# EAGLE design FinalPCBLayoutPoV (EAGLE 7.5.0)
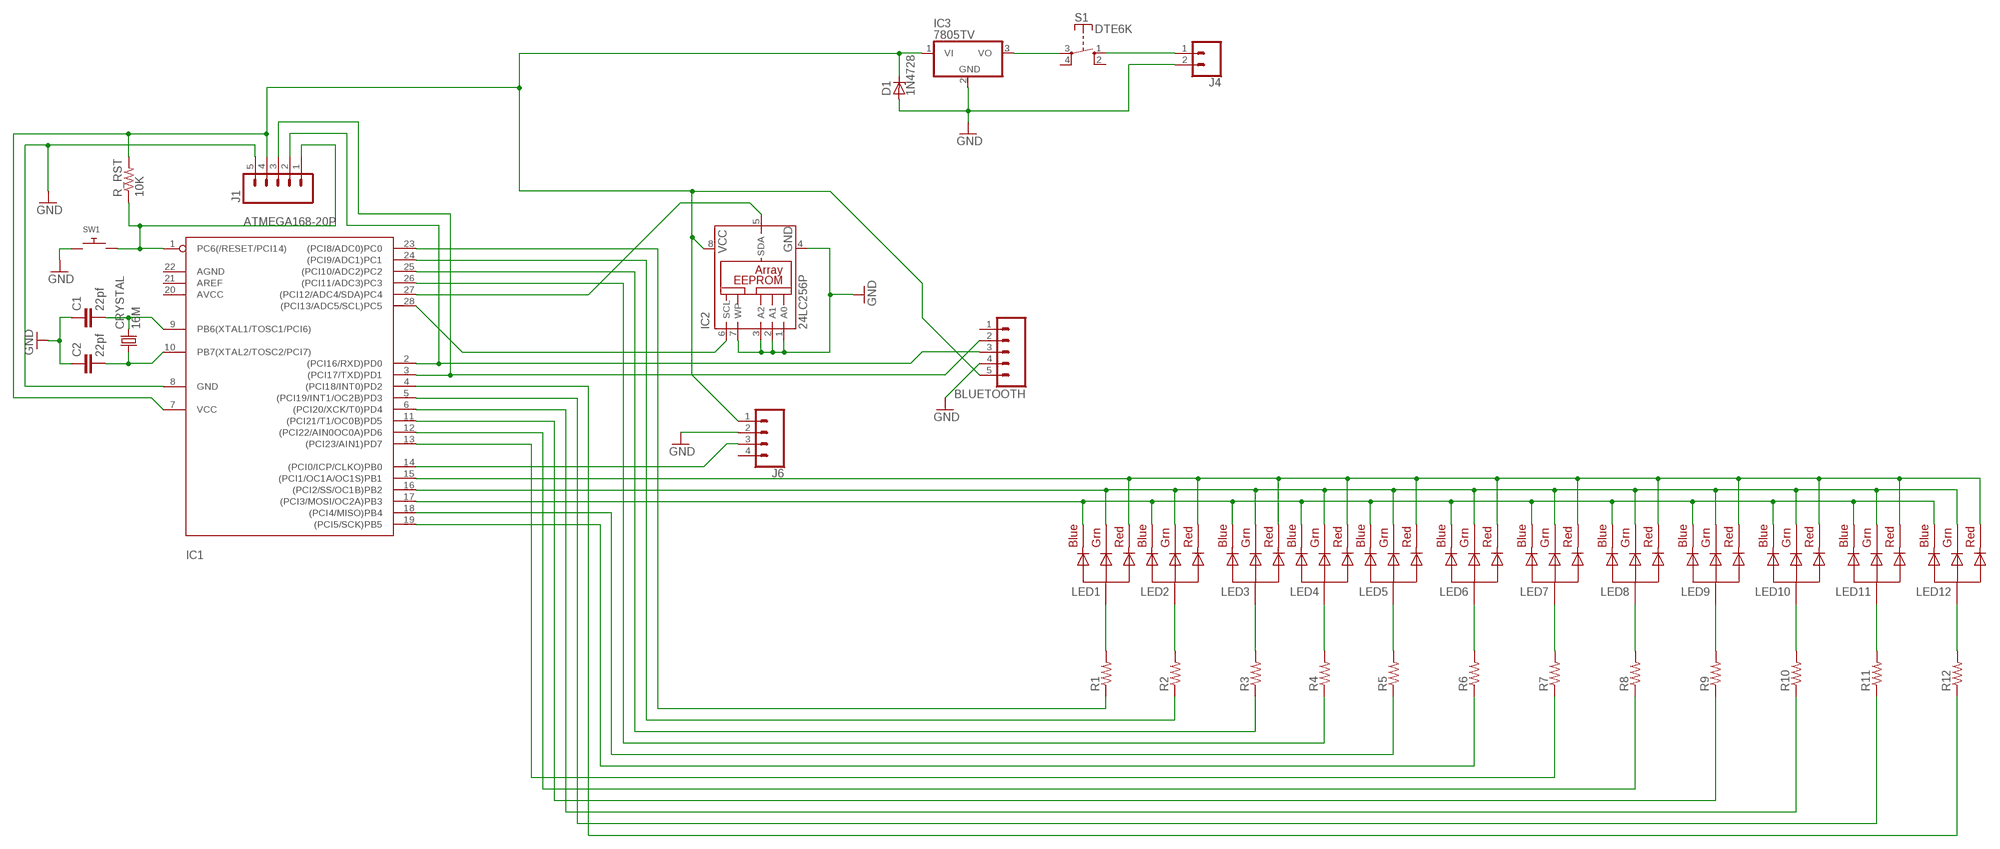
[diagram p0: schematic, sheet 1]

## Parts
BLUETOOTH  M05SCREW  [SCREWTERMINAL-3.5MM-5]
C1  22pf  C-EU025-060X050  [C025-060X050]
C2  22pf  C-EU025-060X050  [C025-060X050]
CRYSTAL  16M  CRYSTALHC49S  [HC49/S]
D1  1N4728  [DO41Z10]
IC1  ATMEGA168-20P  [DIL28-3]
IC2  24LC256P  [DIL8]
IC3  7805TV  [TO220V]
J1  M05SCREW  [SCREWTERMINAL-3.5MM-5]
J4  CONN_02PTH3  [1X02_LONGPADS]
J6  CONN_04LONGPADS  [1X04_LONGPADS]
LED1  RGBLED_CA-5MM  [LED5MMRGB]
LED2  RGBLED_CA-5MM  [LED5MMRGB]
LED3  RGBLED_CA-5MM  [LED5MMRGB]
LED4  RGBLED_CA-5MM  [LED5MMRGB]
LED5  RGBLED_CA-5MM  [LED5MMRGB]
LED6  RGBLED_CA-5MM  [LED5MMRGB]
LED7  RGBLED_CA-5MM  [LED5MMRGB]
LED8  RGBLED_CA-5MM  [LED5MMRGB]
LED9  RGBLED_CA-5MM  [LED5MMRGB]
LED10  RGBLED_CA-5MM  [LED5MMRGB]
LED11  RGBLED_CA-5MM  [LED5MMRGB]
LED12  RGBLED_CA-5MM  [LED5MMRGB]
R1  R-US_0207/10  [0207/10]
R2  R-US_0207/10  [0207/10]
R3  R-US_0207/10  [0207/10]
R4  R-US_0207/10  [0207/10]
R5  R-US_0207/10  [0207/10]
R6  R-US_0207/10  [0207/10]
R7  R-US_0207/10  [0207/10]
R8  R-US_0207/10  [0207/10]
R9  R-US_0207/10  [0207/10]
R10  R-US_0207/10  [0207/10]
R11  R-US_0207/10  [0207/10]
R12  R-US_0207/10  [0207/10]
R_RST  10K  R-US_0207/10  [0207/10]
S1  DTE6K  [DTE6K]
SW1  SWITCH_PUSHBUTTONEVQ-PE  [TACT_PANA-EVQ]

## Nets
CRTL1: C1.2 CRYSTAL.2 IC1.9(PB6(XTAL1/TOSC1/PCI6))
CRTL2: C2.2 CRYSTAL.1 IC1.10(PB7(XTAL2/TOSC2/PCI7))
CRX-BTX: BLUETOOTH.3 IC1.2((PCI16/RXD)PD0) J1.2
CTX-BRX: BLUETOOTH.2 IC1.3((PCI17/TXD)PD1) J1.3
GND: BLUETOOTH.4 C1.1 C2.1 D1.A IC1.8(GND) IC2.1(A0) IC2.2(A1) IC2.3(A2) IC2.4(GND) IC2.7(WP) IC3.2(GND) J1.5 J4.2 J6.2 SW1.P$1
LED1: IC1.23((PCI8/ADC0)PC0) R1.1
LED2: IC1.24((PCI9/ADC1)PC1) R2.1
LED3: IC1.25((PCI10/ADC2)PC2) R3.1
LED4: IC1.26((PCI11/ADC3)PC3) R4.1
LED5: IC1.18((PCI4/MISO)PB4) R5.1
LED6: IC1.19((PCI5/SCK)PB5) R6.1
LED7: IC1.13((PCI23/AIN1)PD7) R7.1
LED8: IC1.12((PCI22/AIN0OC0A)PD6) R8.1
LED9: IC1.11((PCI21/T1/OC0B)PD5) R9.1
LED10: IC1.6((PCI20/XCK/T0)PD4) R10.1
LED11: IC1.5((PCI19/INT1/OC2B)PD3) R11.1
LED12: IC1.4((PCI18/INT0)PD2) R12.1
N$1: IC3.3(VO) S1.3(P)
N$2: J4.1 S1.1(S)
N$3: IC1.14((PCI0/ICP/CLKO)PB0) J6.3
N$12: IC1.27((PCI12/ADC4/SDA)PC4) IC2.5(SDA)
N$13: IC1.28((PCI13/ADC5/SCL)PC5) IC2.6(SCL)
N$34: LED1.2(VCC) R1.2
N$35: LED2.2(VCC) R2.2
N$36: LED3.2(VCC) R3.2
N$37: LED4.2(VCC) R4.2
N$38: LED5.2(VCC) R5.2
N$39: LED6.2(VCC) R6.2
N$40: LED7.2(VCC) R7.2
N$41: LED8.2(VCC) R8.2
N$42: LED9.2(VCC) R9.2
N$43: LED10.2(VCC) R10.2
N$44: LED11.2(VCC) R11.2
N$45: LED12.2(VCC) R12.2
PWM-BLUE: IC1.17((PCI3/MOSI/OC2A)PB3) LED1.4(BLUE) LED2.4(BLUE) LED3.4(BLUE) LED4.4(BLUE) LED5.4(BLUE) LED6.4(BLUE) LED7.4(BLUE) LED8.4(BLUE) LED9.4(BLUE) LED10.4(BLUE) LED11.4(BLUE) LED12.4(BLUE)
PWM-GREEN: IC1.16((PCI2/SS/OC1B)PB2) LED1.3(GREEN) LED2.3(GREEN) LED3.3(GREEN) LED4.3(GREEN) LED5.3(GREEN) LED6.3(GREEN) LED7.3(GREEN) LED8.3(GREEN) LED9.3(GREEN) LED10.3(GREEN) LED11.3(GREEN) LED12.3(GREEN)
PWM-READ: IC1.15((PCI1/OC1A/OC1S)PB1) LED1.1(RED) LED2.1(RED) LED3.1(RED) LED4.1(RED) LED5.1(RED) LED6.1(RED) LED7.1(RED) LED8.1(RED) LED9.1(RED) LED10.1(RED) LED11.1(RED) LED12.1(RED)
RST: IC1.1(PC6(/RESET/PCI14)) J1.1 R_RST.1 SW1.P$2
VCC1: BLUETOOTH.5 D1.C IC1.7(VCC) IC2.8(VCC) IC3.1(VI) J1.4 J6.1 R_RST.2
Unconnected: BLUETOOTH.1 IC1.20(AVCC) IC1.21(AREF) IC1.22(AGND) J6.4 S1.2(S) S1.4(P)

## Library data of the parts
BLUETOOTH J1 = SparkFun-ConnectorsModified:M05: Header 5 Standard 5-pin 0.1" header. Use with straight break away headers (SKU : PRT-00116), right angle break away headers (PRT-00553), swiss pins (PRT-00743), machine pins (PRT-00117), and female headers (PRT-00115). Molex polarized connector foot print use with SKU : PRT-08230 with associated crimp pins and housings.; PROD_ID: Combine 8288+8399
C1 C2 = rcl-2M:C-EU: CAPACITOR, European symbol
CRYSTAL = crystal:CRYSTAL: CRYSTAL; OC_FARNELL: 1667008; OC_NEWARK: unknown
D1 = diode:1N4728: Z DIODE 3.3 V, 1W, 5 percent
IC1 = adafruitModified:ATMEGA168*P: MICROCONTROLLER 16 kBytes FLASH 1 kBytes SRAM 512 Bytes EEPROM USART 8-channel 10 bit ADC
IC2 = microchip:24*: Serial EEPROM I2C; MF: MICROCHIP; MPN: 24LC256-E/P; OC_FARNELL: 9757970; OC_NEWARK: 92C7169
IC3 = linear:78*: Positive VOLTAGE REGULATOR Source: http://cache.national.com/ds/LM/LM78L05.pdf http://www.fairchildsemi.com/ds/LM/LM7805.pdf
J4 = SparkFun-Connectors:CONN_02: Multi connection point. Often used as Generic Header-pin footprint for 0.1 inch spaced/style header connections On any of the 0.1 inch spaced packages, you can populate with these: Break Away Headers - Straight <https://www.sparkfun.com/products/116> (PRT-00116) Break Away Male Headers - Right Angle <https://www.sparkfun.com/products/553> (PRT-00553) Female Headers <https://www.sparkfun.com/products/115> (PRT-00115) Break Away Headers - Machine Pin <https://www.sparkfun.com/products/117> (PRT-00117) Break Away Female Headers - Swiss Machine Pin <https://www.sparkfun.com/products/743> (PRT-00743) For SCREWTERMINALS and SPRING TERMINALS visit here: Screw Terimnals on SparkFun.com <https://www.sparkfun.com/search/results?term=Screw+Terminals> (5mm/3.5mm/2.54mm spacing) This device is also useful as a general connection point to wire up your design to another part of your project. Our various solder wires solder well into these plated through hole pads. Hook-Up Wire - Assortment (Stranded, 22 AWG) <https://www.sparkfun.com/products/11375> (PRT-11375) Hook-Up Wire - Assortment (Solid Core, 22 AWG) <https://www.sparkfun.com/products/11367> (PRT-11367) View the entire wire category on our website here <https://www.sparkfun.com/categories/141> Special notes: Molex polarized connector foot print use with: PRT-08233 with associated crimp pins and housings. 2.54_SCREWTERM for use with PRT-10571. 3.5mm Screw Terminal footprints for PRT-08084 5mm Screw Terminal footprints for use with PRT-08432
J6 = SparkFun-Connectors:CONN_04: Multi connection point. Often used as Generic Header-pin footprint for 0.1 inch spaced/style header connections On any of the 0.1 inch spaced packages, you can populate with these: Break Away Headers - Straight <https://www.sparkfun.com/products/116> (PRT-00116) Break Away Male Headers - Right Angle <https://www.sparkfun.com/products/553> (PRT-00553) Female Headers <https://www.sparkfun.com/products/115> (PRT-00115) Break Away Headers - Machine Pin <https://www.sparkfun.com/products/117> (PRT-00117) Break Away Female Headers - Swiss Machine Pin <https://www.sparkfun.com/products/743> (PRT-00743) For SCREWTERMINALS and SPRING TERMINALS visit here: Screw Terimnals on SparkFun.com <https://www.sparkfun.com/search/results?term=Screw+Terminals> (5mm/3.5mm/2.54mm spacing) This device is also useful as a general connection point to wire up your design to another part of your project. Our various solder wires solder well into these plated through hole pads. Hook-Up Wire - Assortment (Stranded, 22 AWG) <https://www.sparkfun.com/products/11375> (PRT-11375) Hook-Up Wire - Assortment (Solid Core, 22 AWG) <https://www.sparkfun.com/products/11367> (PRT-11367) View the entire wire category on our website here <https://www.sparkfun.com/categories/141> Special notes: Molex polarized connector foot print use with SKU : PRT-08231 with associated crimp pins and housings. 1MM SMD Version SKU: PRT-10208; PROD_ID: CONN-09696
LED1-LED12 = adafruitModified:RGBLED_CA: RGB LED, common-anode 5MM Staggered pins 5mm Piranha package http://www.ladyada.net/library/pcb/eaglelibrary.html
R1-R12 R_RST = rcl-2M:R-US_: RESISTOR, American symbol
S1 = switch-misc:DT: ITT SWITCH
SW1 = adafruitMs:SWITCH_PUSHBUTTON: Buttons SOFTTOUCHSMD_SJ - Soft touch temporary push button (Super Junk Akihabara) Compatible with SKPMANE010 [Mouser: 688-SKPMAN] C&K_KSS = Digikey: KSS221GLFS

## Net classes
0 default: width 0.61 mm, drill 0.406 mm, clearance 0.61 mm

## Board
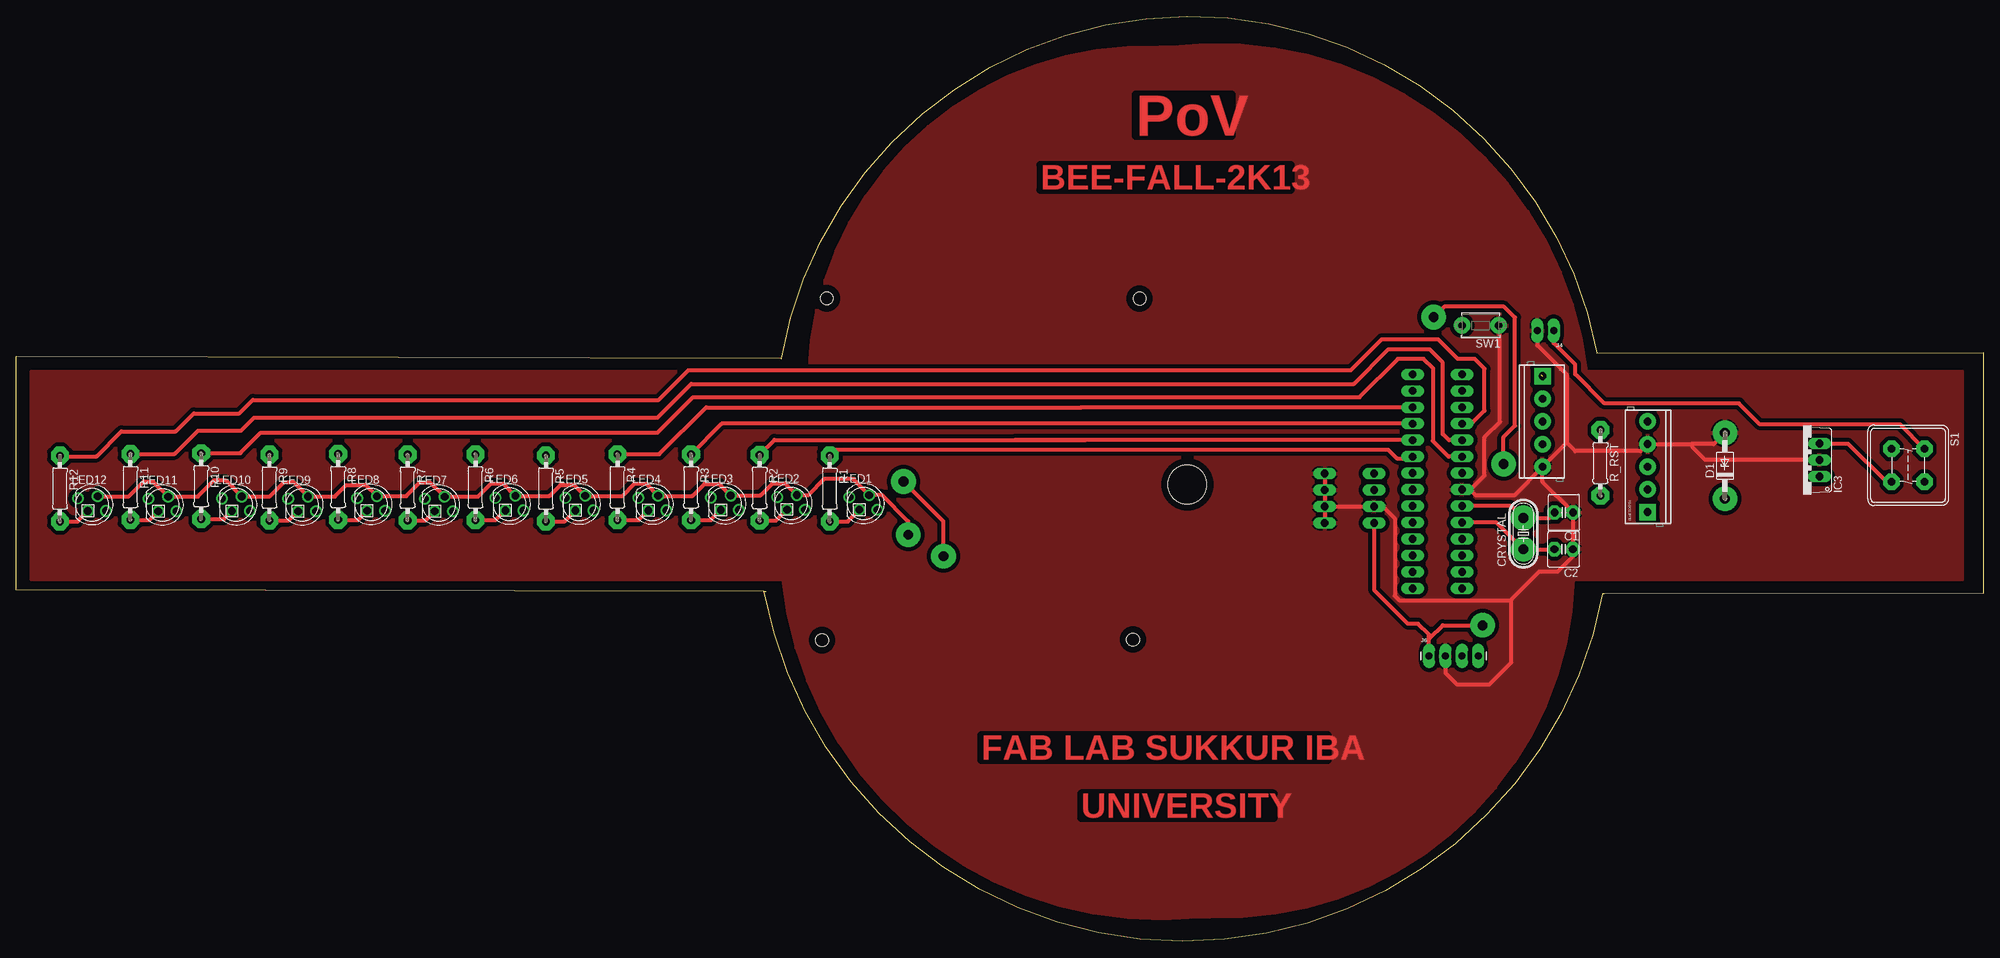
[diagram p1: board, top side]
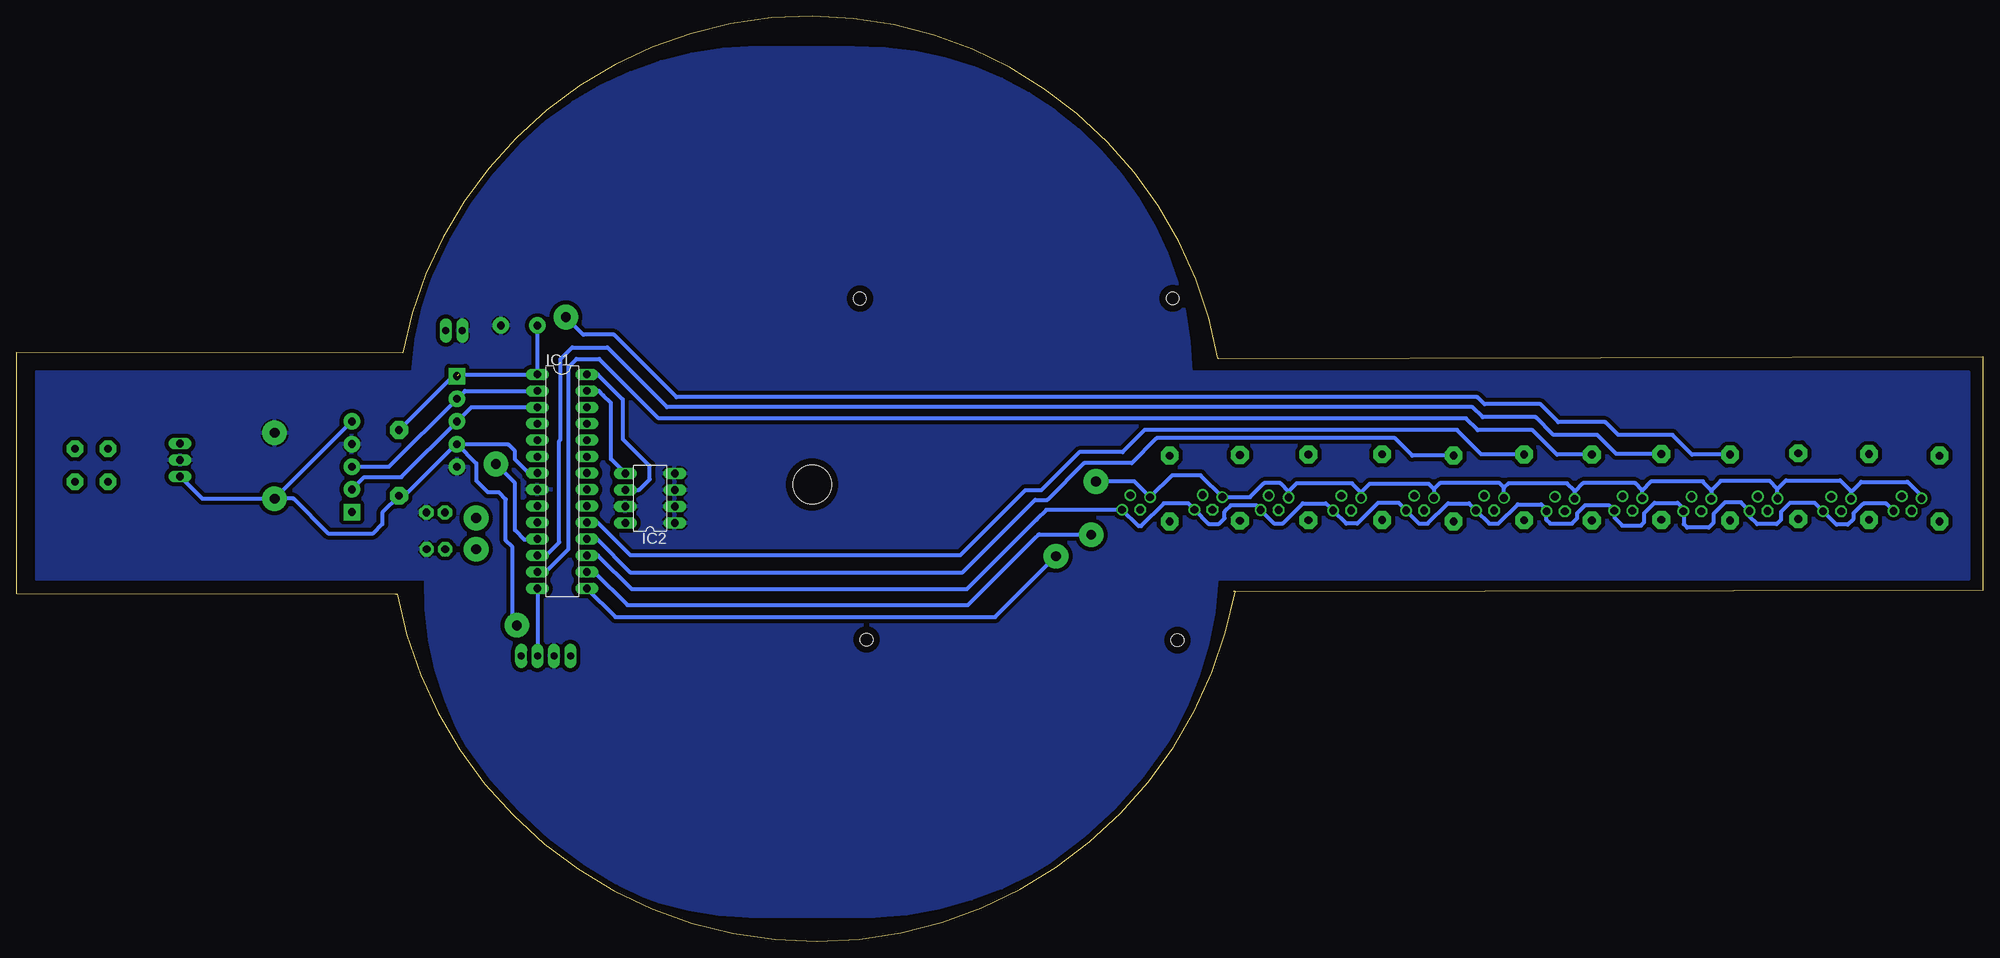
[diagram p2: board, bottom side, seen from below]

Size 303.55 x 142.81 mm. Coordinates in mm from the lower left corner, seen from the top.
Outline: 245.05,53.65 303.55,53.72 303.55,90.9 243.93,90.83
Outline: 115.44,54.04 0,54.24 0,90.25 118.04,90
Outline: 118.09,90 arc-159 243.94,90.84
Outline: 244.8,53.66 arc-159 115.44,54.04
Outline: 115.44,54.04 115.7,54.04
Outline: 245.05,53.66 244.79,53.66
Outline: 118.03,90 118.08,90
Copper layers (1*16): Top 0.035mm / dielectric 1.5mm / Bottom 0.035mm
Design rules "default *": minimum track width 10mil, minimum drill 24mil, track to track 8mil, track to pad 8mil, pad to pad 8mil, via to via 8mil, smd to smd 8mil, copper to edge 40mil, drill to drill 8mil, minimum pad ring 10mil, minimum via ring 8mil, stop-mask expansion 4mil, vias tented up to drill 0mil, thermal gap 10mil
Holes 6 mm at 180.71,70.53
Holes 2 mm at 125.09,99.27 124.37,46.49 172.34,46.59 173.36,99.21

### Footprints (pad centres in the part's own frame; a part is rotated, then mirrored left to right if it is on the bottom)
SCREWTERMINAL-3.5MM-5 = drill 1.2 pad 2.54 square: 1 0,0 | drill 1.2 pad 2.54: 2 3.5,0; 3 7,0; 4 10.5,0; 5 14,0
C025-060X050 = drill 1.2 pad 2.184 octagon: 1 -1.429,0; 2 1.429,0
HC49/S = drill 1.5 pad 3.81: 1 -2.413,0; 2 2.413,0
DO41Z10 = drill 1.5 pad 3.81: A 5.08,0; C -5.08,0
DIL28-3 = drill 1.2 long: 1 -16.51,-3.81; 2 -13.97,-3.81; 3 -11.43,-3.81; 4 -8.89,-3.81; 5 -6.35,-3.81; 6 -3.81,-3.81; 7 -1.27,-3.81; 8 1.27,-3.81; 9 3.81,-3.81; 10 6.35,-3.81; 11 8.89,-3.81; 12 11.43,-3.81; 13 13.97,-3.81; 14 16.51,-3.81; 15 16.51,3.81; 16 13.97,3.81; 17 11.43,3.81; 18 8.89,3.81; 19 6.35,3.81; 20 3.81,3.81; 21 1.27,3.81; 22 -1.27,3.81; 23 -3.81,3.81; 24 -6.35,3.81; 25 -8.89,3.81; 26 -11.43,3.81; 27 -13.97,3.81; 28 -16.51,3.81
DIL8 = drill 1.2 long: 1 -3.81,-3.81; 2 -1.27,-3.81; 3 1.27,-3.81; 4 3.81,-3.81; 5 3.81,3.81; 6 1.27,3.81; 7 -1.27,3.81; 8 -3.81,3.81
TO220V = drill 1.2 long: 1 -2.54,-2.54; 2 0,-2.54; 3 2.54,-2.54
1X02_LONGPADS = drill 1.118 pad 1.88 long: 1 0,0; 2 2.54,0
1X04_LONGPADS = drill 1.118 pad 1.88 long: 1 0,0; 2 2.54,0; 3 5.08,0; 4 7.62,0
LED5MMRGB = drill 1.2 pad 1.778: 1 -2.159,0.968; 3 0.889,1.286; 4 2.159,-0.968 | drill 1.2 pad 1.778 octagon: 2 -0.635,-0.968
0207/10 = drill 1.2 pad 2.75 octagon: 1 -5.08,0; 2 5.08,0
DTE6K = drill 1.118 pad 2.54 octagon: 1 -2.54,2.54; 2 2.54,2.54; 3 2.54,-2.54; 4 -2.54,-2.54
TACT_PANA-EVQ = drill 1.2 pad 2.54: P$1 -2.774,0; P$2 2.853,0

### Placement (x,y rotation side)
BLUETOOTH  251.75,66.26 90 top
C1  238.83,66.19 180 top
C2  238.79,60.54 180 top
CRYSTAL  232.58,62.93 90 top
D1  263.68,73.41 90 top
IC1  219.31,71.01 270 bottom
IC2  205.72,68.41 90 bottom
IC3  275.74,74.31 90 top
J1  235.53,87.25 270 top
J4  237.27,94.28 180 top
J6  218.01,44.08 0 top
LED1  130.74,67.59 0 top
LED2  119.58,67.61 0 top
LED3  109.36,67.55 0 top
LED4  98.17,67.49 0 top
LED5  86.92,67.49 0 top
LED6  76.13,67.49 0 top
LED7  65.21,67.35 0 top
LED8  54.77,67.43 0 top
LED9  44.14,67.37 0 top
LED10  33.92,67.39 0 top
LED11  22.57,67.35 0 top
LED12  11.69,67.41 0 top
R1  125.54,69.89 270 top
R2  114.72,70.01 270 top
R3  104.12,70.09 270 top
R4  92.77,70.11 270 top
R5  81.74,69.91 270 top
R6  70.87,70.09 270 top
R7  60.39,70.05 270 top
R8  49.67,70.15 270 top
R9  39.08,70.05 270 top
R10  28.54,70.27 270 top
R11  17.63,70.15 270 top
R12  6.75,69.89 270 top
R_RST  244.48,73.86 270 top
S1  291.93,73.49 270 top
SW1  225.98,95.06 180 top

### Tracks (layer width: path | path; a pad name or v marks a point on that pad's centre or on a via)
CRTL1
  Top 0.61: C1.2 236.57,65.35 CRYSTAL.2 230.72,67.2 IC1.9
CRTL2
  Top 0.61: C2.2 237.34,60.52 CRYSTAL.1 228.44,64.66 IC1.10
CRX-BTX
  Bottom 0.61: IC1.2 234.3,84.98 J1.2 246.02,73.26 BLUETOOTH.3
CTX-BRX
  Bottom 0.61: IC1.3 233.34,82.44 J1.3 244.12,71.66 249.85,71.66 BLUETOOTH.2
GND
  Top 0.61: IC2.2 IC2.1 | C1.1 240.26,59.46 237.83,57.03 234.97,57.03 230.71,52.77 | C1.1 235.53,70.91 J1.5 | J1.5 235.53,73.19 231.2,68.86 225.28,68.86 224.4,69.74 | 239.26,76.98 239.26,87.47 234.73,92.01 J4.2 | 239.26,76.98 J1.5 | SW1.P$1 228.95,94.87 228.95,80.2 226.57,77.82 226.57,71.91 224.4,69.74 | IC2.2 IC2.7 210.89,67.14 212.74,65.29 212.74,53.33 213.42,52.65 230.59,52.65 230.71,52.77 | 240.28,66.16 C1.1 | IC3.2 260.68,74.31 258.57,76.41 258.57,76.66 258.47,76.76 | 258.47,76.76 BLUETOOTH.4 250.65,75.66 240.57,75.66 239.26,76.97 239.26,76.98 | 241.17,66.19 C1.1 | J6.2 220.55,41.44 222.32,39.66 227.32,39.66 230.71,43.05 230.71,52.77 | IC2.4 IC2.3 IC2.2 | IC1.8 224.4,69.74 | D1.A 261.95,76.76 258.47,76.76
  pour Top: 2.33,55.91 118.33,55.91 arc90 182.32,3.91 184.32,3.91 arc90 240.32,55.91 300.32,55.91 300.32,87.91 242.32,87.91 arc90 178.32,137.91 176.32,137.91 arc90 122.33,87.91 2.33,87.91
  pour Bottom: 2.33,55.91 118.33,55.91 arc90 176.32,3.91 190.32,3.91 arc90 240.32,55.91 300.32,55.91 300.32,87.91 242.32,87.91 arc90 184.32,137.91 174.32,137.91 arc90 122.33,87.91 2.33,87.91
LED1
  Top 0.61: 215.35,74.97 IC1.23 215.22,74.54 213.07,74.54 211.7,75.91 126.48,75.91 R1.1
LED2
  Top 0.61: R2.1 114.7,75.12 116.99,77.41 154.15,77.41 | 154.15,77.41 165.07,77.41 | IC1.24 154.2,77.36 154.15,77.41
LED3
  Top 0.61: 104.11,75.19 R3.1 108.85,79.9 IC1.25
LED4
  Top 0.61: R4.1 99.22,75.19 106.47,82.44 164.35,82.44 165.36,82.44 IC1.26
LED5
  Bottom 0.61: R5.1 88.11,74.99 90.78,77.67 127.57,77.67 131.41,73.83 138.76,73.83 144.43,68.16 146.32,68.16 157.52,56.97 208.78,56.97 213.93,62.12 IC1.18
LED6
  Bottom 0.61: R6.1 77.46,75.17 81.23,78.94 129.42,78.94 132.83,75.52 139.51,75.52 145.37,69.66 147.82,69.66 157.85,59.63 208.78,59.63 213.81,64.66 IC1.19
LED7
  Bottom 0.61: IC1.13 221.84,57.04 218.33,60.54 218.33,88.65 217.07,89.91 213.57,89.91 204.38,80.72 79.83,80.72 78.02,78.91 69.58,78.91 65.79,75.13 R7.1
LED8
  Bottom 0.61: IC1.12 221.77,59.58 219.76,61.58 219.76,77.25 219.57,77.44 219.57,89.86 217.76,91.66 212.32,91.66 203.14,82.48 78.83,82.48 77.26,80.91 69.08,80.91 66.33,78.16 59.58,78.16 56.64,75.23 R8.1
LED9  (via drill 1.5 pad 3.81)
  Top 0.61: v218.74,96.37 220.35,97.98 229.58,97.98 231.27,96.29 231.27,79.59 229.51,77.83 v229.51,73.68
  Bottom 0.61: IC1.11 223.2,62.04 225.16,62.04 226.59,63.47 226.59,70.75 v229.51,73.68 | v218.74,96.37 216.03,93.66 211.32,93.66 201.67,84.01 78.08,84.01 76.98,82.91 68.33,82.91 65.58,80.16 58.33,80.16 56.33,78.16 47.98,78.16 44.95,75.13 R9.1
LED10
  Top 0.61: IC1.6 221.02,74.82 218.59,77.25 218.66,77.31 218.66,88.43 217.17,89.91 213.2,89.91 207.31,84.02 104.48,84.02 98.97,78.51 37.74,78.51 34.58,75.35 R10.1
LED11
  Top 0.61: IC1.5 221.08,77.36 220.16,78.29 220.16,89.34 218.08,91.41 211.76,91.41 206.4,86.06 104.17,86.06 98.97,80.85 36.7,80.85 34.69,78.84 28.05,78.84 24.45,75.23 R11.1
LED12
  Top 0.61: R12.1 6.85,74.87 12.39,74.87 16.23,78.71 24.61,78.71 27.4,81.5 34.43,81.5 36.51,83.58 99.17,83.58 103.75,88.17 205.96,88.17 210.7,92.91 219.44,92.91 222.44,89.91 225.07,89.91 226.57,88.41 226.57,81.91 224.56,79.9 IC1.4
N$1
  Top 0.61: S1.3 288.57,70.95 282.68,76.85 IC3.3
N$2
  Top 0.61: S1.1 290.71,79.79 269.07,79.79 265.82,83.04 245.07,83.04 240.57,87.54 240.57,89.04 237.27,92.34 J4.1
N$3
  Bottom 0.61: IC1.14 223.12,44.11 J6.3
N$12
  Bottom 0.61: IC2.5 211.77,74.45 211.77,83.11 212.95,84.29 213.57,84.91 213.64,84.98 IC1.27
N$13
  Bottom 0.61: IC2.6 207.44,69.68 205.79,71.33 205.79,73.41 209.95,77.57 209.95,83.66 213.81,87.52 IC1.28
N$34
  Top 0.61: R1.2 128.29,64.81 LED1.2
N$35
  Top 0.61: R2.2 117.24,64.93 LED2.2
N$36
  Top 0.61: R3.2 107.16,65.01 LED3.2
N$37
  Top 0.61: R4.2 96.04,65.03 LED4.2
N$38
  Top 0.61: R5.2 84.59,64.83 LED5.2
N$39
  Top 0.61: R6.2 73.98,65.01 LED6.2
N$40
  Top 0.61: R7.2 63.16,64.97 LED7.2
N$41
  Top 0.61: R8.2 52.75,65.07 LED8.2
N$42
  Top 0.61: R9.2 42.07,64.97 LED9.2
N$43
  Top 0.61: R10.2 32.05,65.19 LED10.2
N$44
  Top 0.61: R11.2 20.62,65.07 LED11.2
N$45
  Top 0.61: R12.2 9.43,64.81 LED12.2
PWM-BLUE
  Bottom 0.61: LED3.4 109.48,64.54 108.11,64.54 105.02,67.63 101.45,67.63 100.83,67.02 100.82,67.02 LED4.4 98.28,64.48 96.58,64.48 93.35,67.71 90.25,67.71 89.08,66.54 LED5.4 89.11,66.53 87.06,64.48 85.75,64.48 82.61,67.61 79.36,67.61 78.28,66.54 LED6.4 76.24,64.48 74.84,64.48 71.84,67.47 68.23,67.47 67.37,66.62 LED7.4 67.39,66.36 67.39,65.07 66.82,64.5 63.48,64.5 62.69,65.29 62.69,66.06 61.42,67.33 57.8,67.33 LED8.4 56.93,65.43 55.71,64.2 52.83,64.2 52.31,64.72 52.31,66.12 50.75,67.69 47.17,67.69 46.3,66.82 LED9.4 46.24,66.35 46.24,64.39 45.71,63.86 42.39,63.86 41.64,64.62 41.64,65.97 39.85,67.75 37.4,67.75 LED10.4 36.08,65.61 34.89,64.42 31.87,64.42 31.22,65.07 31.22,66.3 29.83,67.69 26.03,67.69 LED11.4 22.66,64.32 20.92,64.32 20.01,65.23 20.01,66.1 18.52,67.59 15,67.59 LED12.4 | 111.52,66.62 LED3.4 | LED3.4 112.23,67.3 116.13,67.3 117.08,66.34 117.08,65.29 117.92,64.46 119.56,64.46 LED2.4 122.69,67.59 126.47,67.59 129.97,64.08 130.35,64.08 LED1.4 144.57,66.62 146.07,65.12 146.8,64.39 156.83,54.37 208.58,54.37 213.8,59.58 IC1.17
PWM-GREEN  (via drill 1.5 pad 3.81)
  Top 0.61: LED12.3 17.36,68.7 19.69,71.03 21.07,71.03 LED11.3 28.04,68.64 30.58,71.18 32.3,71.18 LED10.3 39.13,68.68 41.36,70.91 42.78,70.91 LED9.3 49.17,68.66 50.94,70.43 52.19,70.43 52.23,70.47 53.91,70.47 LED8.3 60.19,68.72 62.29,70.83 63.91,70.83 LED7.3 71.28,68.64 73.29,70.65 75.14,70.65 LED6.3 82.29,68.78 83.98,70.47 86.12,70.47 LED5.3 93.58,68.78 95.45,70.65 97.19,70.65 LED4.3 104.34,68.78 106.19,70.63 108.46,70.63 LED3.3 114.84,68.84 116.71,70.71 118.66,70.71 LED2.3 122.24,68.9 124.78,71.43 129.26,71.43 129.26,71.24 LED1.3 133.61,68.88 137.66,64.83 v137.66,62.75
  Bottom 0.61: IC1.16 214.38,57.04 209.23,51.9 156.68,51.9 146.31,62.27 145.82,62.75 | 145.82,62.75 145.7,62.88 | v137.66,62.75 145.82,62.75
PWM-READ  (via drill 1.5 pad 3.81)
  Top 0.61: v143.09,59.47 143.09,64.82 v136.92,70.99
  Bottom 0.61: 107.2,69.46 108.49,70.75 110.99,70.75 113.16,68.58 LED2.1 120.79,71.95 125.19,71.95 LED1.1 131.01,70.99 v136.92,70.99 | 107.2,69.46 LED3.1 | 96.01,69.3 97.42,70.71 105.96,70.71 107.2,69.46 | 96.01,69.3 LED4.1 | 96.01,69.3 94.67,70.65 85.63,70.65 84.78,69.8 | 73.96,70.03 74.66,70.73 83.84,70.73 84.78,69.8 | 84.78,69.8 84.78,68.48 LED5.1 | LED7.1 63.05,69.51 | 63.05,69.51 64.26,70.72 73.28,70.72 73.96,70.03 | 63.05,69.51 62.98,69.51 61.76,70.73 53.72,70.73 52.61,69.62 | LED8.1 52.61,69.62 | 52.61,69.62 51.19,71.05 43.43,71.05 | 43.43,71.05 43.26,71.05 | LED6.1 73.97,70.03 73.96,70.03 | LED12.1 9.53,68.81 11.71,70.99 11.75,70.95 18.84,70.95 20.41,69.37 | LED11.1 20.41,69.37 | 20.41,69.37 20.41,69.48 22.09,71.16 30.45,71.16 31.76,69.85 | LED10.1 31.76,69.85 | 31.76,69.85 32.97,71.07 40.51,71.07 41.98,69.59 | 41.98,69.59 LED9.1 | 41.98,69.59 43.43,71.05 | IC1.15 211.08,50.08 152.48,50.08 v143.09,59.47
RST  (1 unrouted)
  Bottom 0.61: SW1.P$2 IC1.1 235.07,87.52 235.26,87.52 235.89,87.52 R_RST.1
VCC1  (via drill 1.5 pad 3.81)
  Top 0.61: IC2.8 209.53,54.28 214.77,49.04 216.32,49.04 218.01,47.35 218.01,46.66 | J6.1 218.01,46.66 | v226.3,48.79 220.13,48.79 218.01,46.66
  Bottom 0.61: J1.4 232.57,73.78 232.57,71.14 230.75,69.32 229.06,69.32 227.99,68.25 | 227.95,68.21 227.99,68.25 | 227.99,68.25 227.99,61.88 226.98,60.87 226.98,49.47 v226.3,48.79 | 235.53,76.47 J1.4 | J1.4 235.87,76.41 236.07,76.41 243.71,68.78 R_RST.2 247.07,66.18 247.07,64.41 248.57,62.91 255.32,62.91 260.75,68.33 D1.C | IC1.7 224.44,72.28 226.57,74.41 226.57,75.66 227.57,76.66 235.45,76.66 J1.4 | BLUETOOTH.5 D1.C | IC3.1 274.84,68.33 D1.C

### Text on the board
Top: PoV | BEE-FALL-2K13 | FAB LAB SUKKUR IBA | UNIVERSITY